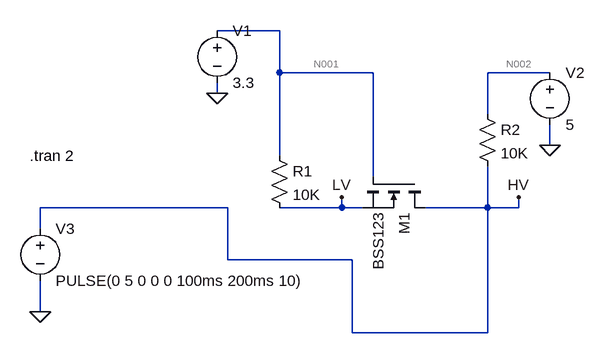
[diagram p0: schematic ip_at_HV_side.asc]
ip_at_HV_side.asc, the LTspice schematic file:
Version 4
SHEET 1 880 680
WIRE 96 -112 0 -112
WIRE 96 -48 96 -112
WIRE 240 -48 96 -48
WIRE 512 -48 416 -48
WIRE 0 -16 0 -32
WIRE 416 16 416 -48
WIRE 512 64 512 32
WIRE 96 80 96 -48
WIRE 240 112 240 -48
WIRE 16 160 -272 160
WIRE 192 160 192 144
WIRE 192 160 96 160
WIRE 224 160 192 160
WIRE 416 160 416 96
WIRE 416 160 320 160
WIRE 464 160 464 144
WIRE 464 160 416 160
WIRE -272 192 -272 160
WIRE 16 240 16 160
WIRE 208 240 16 240
WIRE -272 320 -272 272
WIRE 208 352 208 240
WIRE 416 352 416 160
WIRE 416 352 208 352
FLAG 0 -16 0
FLAG 512 64 0
FLAG -272 320 0
FLAG 464 144 HV
FLAG 192 144 LV
SYMBOL nmos 320 112 R90
SYMATTR InstName M1
SYMATTR Value BSS123
SYMBOL res 80 64 R0
SYMATTR InstName R1
SYMATTR Value 10K
SYMBOL res 400 0 R0
SYMATTR InstName R2
SYMATTR Value 10K
SYMBOL voltage 0 -128 R0
SYMATTR InstName V1
SYMATTR Value 3.3
SYMBOL voltage 512 -64 R0
SYMATTR InstName V2
SYMATTR Value 5
SYMBOL voltage -272 176 R0
SYMATTR InstName V3
SYMATTR Value PULSE(0 5 0 0 0 100ms 200ms 10)
TEXT -288 80 Left 2 !.tran 2

The netlist it stands for:
* ip_at_HV_side.asc
M1 HV N001 LV LV BSS123
R1 N001 LV 10K
R2 N002 HV 10K
V1 N001 0 3.3
V2 N002 0 5
V3 HV 0 PULSE(0 5 0 0 0 100ms 200ms 10)
.model NMOS NMOS
.model PMOS PMOS
.lib standard.mos
.tran 2
.backanno
.end

* Results of the author's LTspice run, read from the files saved beside the schematic
* Operating Point, zero values left out:
*   V(n001) = 3.3 V
*   V(lv) = 1.579 mV
*   V(n002) = 5 V
*   Id(M1) = -329.8 µA
*   Is(M1) = 329.8 µA
*   I(R2) = 500 µA
*   I(R1) = 329.8 µA
*   I(V3) = 829.8 µA
*   I(V2) = -500 µA
*   I(V1) = -329.8 µA
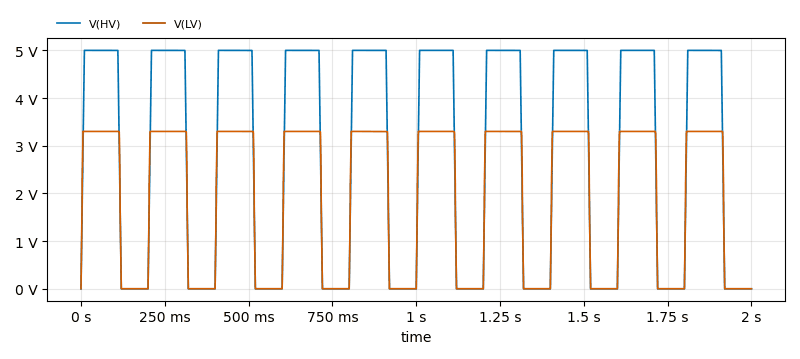
[diagram p1: Transient Analysis of ip_at_HV_side.asc, plotted from the saved traces]
* Transient Analysis, 1 run:
*   V(HV): min 0 V, max 5 V, average 2.75 V, rms 3.653 V, last 0 V
*   V(LV): min 1.552 mV, max 3.302 V, average 1.883 V, rms 2.474 V, last 1.579 mV